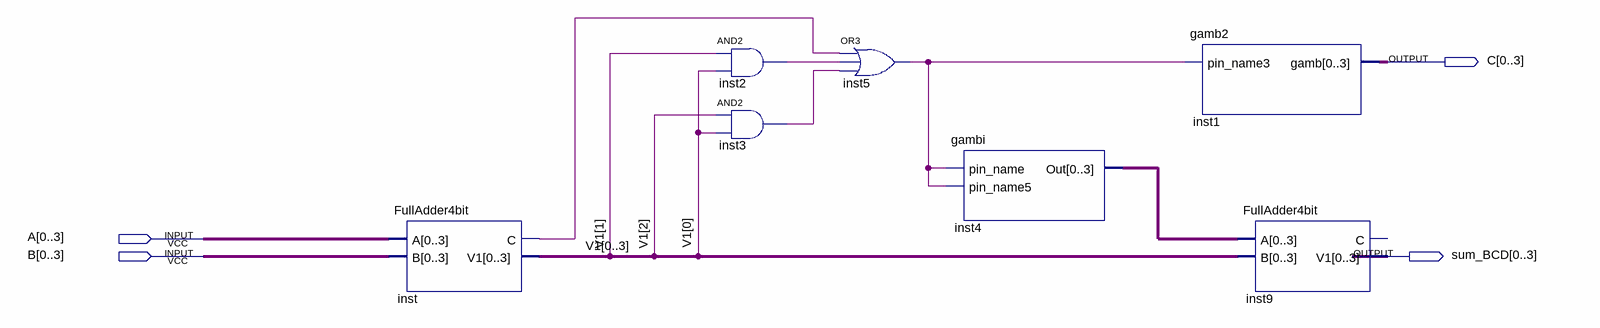
[diagram p0: schematic sheet]
// Quartus schematic Adder_BCD.bdf as structural Verilog: 7 symbols, 4 pins
module Adder_BCD (
  input  [0:3] A,
  input  [0:3] B,
  output [0:3] C,
  output [0:3] sum_BCD
);

  wire inst2_out, inst3_out, inst5_out, inst_c;
  wire [3:0] inst4_out, V1;

  FullAdder4bit inst (.A(A), .B(B), .C(inst_c), .V1({V1[0], V1[1], V1[2], V1[3]}));
  and inst2 (inst2_out, V1[1], V1[0]);
  and inst3 (inst3_out, V1[2], V1[0]);
  or inst5 (inst5_out, inst_c, inst2_out, inst3_out);
  gambi inst4 (.pin_name(inst5_out), .pin_name5(inst5_out), .Out(inst4_out));
  gamb2 inst1 (.pin_name3(inst5_out), .gamb(C));
  FullAdder4bit inst9 (.A(inst4_out), .B({V1[0], V1[1], V1[2], V1[3]}), .V1(sum_BCD));  // open: C
endmodule
